# Altium schematic sheet MZ.SchDoc
size A
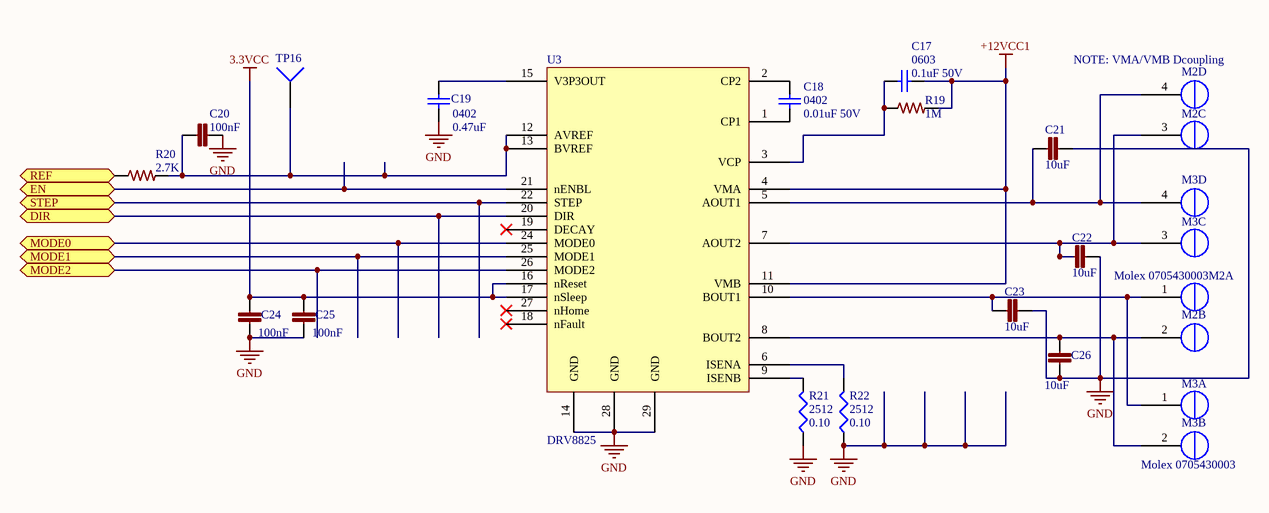
[diagram p0: MZ.SchDoc]

## Parts
C17  0603  value 0.1uF 50V  [1608[0603]]
C18  value 0.01uF 50V  [C0402]  (hidden comment: 0402)
C19  value 0.47uF  [C0402]  (hidden comment: 0402)
C20  100nF  [C0402]
C21  10uF  [C0603]
C22  10uF  [C0603]
C23  10uF  [C0603]
C24  100nF  [C0402]
C25  100nF  [C0402]
C26  10uF  [C0603]
M2  Molex 0705430003  [4POL254]  (parts A,B,C,D of 4)
M3  Molex 0705430003  [4POL254]  (parts A,B,C,D of 4)
R19  1M  [R0402]
R20  2.7K  [R0402]
R21  2512  value 0.10  [2512R-0.55]
R22  2512  value 0.10  [2512R-0.55]
TP16  TP4  [TP-2]  (value not drawn)
U3  DRV8825  [DRV8825PWPR]

## Ports
DIR, EN, MODE0, MODE1, MODE2, REF, STEP

## Nets
3.3VCC: C24.1 C25.1 U3.16(nReset) U3.17(nSleep)
+12VCC1: C17.1 R19.2 U3.4(VMA) U3.11(VMB)
GND: C19.1 C20.2 C21.2 C22.2 C23.2 C24.2 C25.2 C26.2 R21.1 R22.1 U3.14(GND) U3.28(GND) U3.29(GND)
DIR: U3.20(DIR) ; port DIR
EN: U3.21(nENBL) ; port EN
MODE0: U3.24(MODE0) ; port MODE0
MODE1: U3.25(MODE1) ; port MODE1
MODE2: U3.26(MODE2) ; port MODE2
REF: R20.1 ; port REF
STEP: U3.22(STEP) ; port STEP
NetC17_2: C17.2 R19.1 U3.3(VCP)
NetC18_1: C18.1 U3.1(CP1)
NetC18_2: C18.2 U3.2(CP2)
NetC19_2: C19.2 U3.15(V3P3OUT)
NetC20_1: C20.1 R20.2 TP16.1 U3.12(AVREF) U3.13(BVREF)
NetC21_1: C21.1 M2.4(OUT1B) M3.4(OUT1B) U3.5(AOUT1)
NetC22_1: C22.1 M2.3(OUT1A) M3.3(OUT1A) U3.7(AOUT2)
NetC23_1: C23.1 M2.1(OUT2B) M3.1(OUT2B) U3.10(BOUT1)
NetC26_1: C26.1 M2.2(OUT2A) M3.2(OUT2A) U3.8(BOUT2)
NetR21_2: R21.2 U3.9(ISENB)
NetR22_2: R22.2 U3.6(ISENA)

Not connected (* = marked no-connect by the designer): U3 18(nFault)* 19(DECAY)* 23(NC) 27(nHome)*

## Notes on the sheet
- (near M2) NOTE: VMA/VMB Dcoupling

## Library data of the parts
C17 = Cap Semi: Capacitor (Semiconductor SIM Model); Published: 8-Jun-2000; LatestRevisionDate: 29-May-2009; LatestRevisionNote: IPC-7351 Footprint Added.; PackageReference: C1206; Publisher: Altium Limited; PackageDescription: Chip Capacitor
C18 = GRM155R71H103JA88D: CAP CER 10000PF 50V X7R 0402; MFR: Murata; Tolerance: 10%; Voltage: 6.3VDC; Published: 10 - Dec - 2014; LatestRevisionDate: 10 - Dec - 2014; LatestRevisionNote: Ultimachine Footprint Added; Publisher: Ultimachine; Component Type: Chip Capacitor; MFR Part #: GRM155R71H103JA88D; Part Description: CAP CER 10000PF 50V X7R 0402; Mounting Type: SMT 0402; Datasheet: http://search.murata.co.jp/Ceramy/image/img/A01X/G101/ENG/GRM155R71H103JA88-01.pdf; Height: 0.5 ±0.05mm; Digikey #: 490-7763-1-ND; PackageReference: 0402
C19 = GRM155R60J474KE19D: 0.47uF 6.3v C0402 - GRM155R60J474KE19D; MFR: Murata; Part Description: CAP CER 0.47UF 6.3V 10% X5R 0402; Tolerance: 10%; Voltage: 6.3VDC; Published: 10 - Dec - 2014; LatestRevisionDate: 10 - Dec - 2014; LatestRevisionNote: Ultimachine Footprint Added; Publisher: Ultimachine; Component Type: Chip Capacitor; MFR Part #: GRM155R60J474KE19D; Mounting Type: SMT 0402; Datasheet: http://search.murata.co.jp/Ceramy/image/img/A01X/G101/ENG/GRM155R60J474KE19-01.pdf; Height: 0.5 ±0.05mm; PackageReference: 0402
C20 C24 C25 = GRM155R71C104KA88D: CAP CER 0402 100nF 16V 10% X7R; LastRevisionNote: ImportComponents; Published: 23-Apr-2014; Publisher: UltiMachine; LastRevisionDate: 23-Apr-2014; ManufacturerPartNumber: GRM155R71C104KA88D; VALUE: 100nF
C21-C23 C26 = CC0603ZRY5V6BB105: CAP CER 0603 1uF 10V Y5V; LastRevisionNote: ImportComponents; Published: 23-Apr-2014; Publisher: UltiMachine; LastRevisionDate: 23-Apr-2014; ManufacturerPartNumber: CC0603ZRY5V6BB105; VALUE: 10uF
M2 M3 = Molex 0705430003 Alt: Molex 4 Pin Clip Connector
R19 = ERJ2GEJ105X: RES 0402 1M 100mW 5%; LastRevisionNote: ImportComponents; Published: 23-Apr-2014; Publisher: UltiMachine; LastRevisionDate: 23-Apr-2014; ManufacturerPartNumber: ERJ2GEJ105X; VALUE: 1M
R20 = ERJ-2RKF2701X: RES SMD 2.7K OHM 1% 1/10W 0402; Manufacturer: Panasonic; ManufacturerPartNumber: ERJ2GEJ105X; LastRevisionNote: ImportComponents; Published: 23-Apr-2014; Publisher: Adam; LastRevisionDate: 23-Apr-2014; VALUE: 2.7K
R21 R22 = CSRN2512FTR100: RES SMD 0.1 OHM 1% 2W 2512; MFR: Stackpole ELectronics Inc; PackageReference: 2512; MFR #: CSRN2512FTR100; Digikey #: CSRN2512FTR100TR-ND; PDF: http://www.seielect.com/catalog/SEI-CSR_CSRN.pdf
TP16 = Socket: LatestRevisionDate: 17-Jul-2002; LatestRevisionNote: Re-released for DXP Platform.; Publisher: Altium Limited
U3 = DRV8825: DRV8825 Ti Stepper Driver; Manufacture: Texas Instruments; Mountining Type: SMD - Ti PowerPAD Package; Voltage: 8.2-45VDC; Cost (1000 qty): 2.25; Part Number: DRV8825PWPR; Status: In-Production; Pins: 28 Pins and one Exposed Pad; Datasheet: http://www.ti.com/lit/gpn/drv8825; Height: 1.2mm; Tolerance: N/A; Type: Stepper Driver - Integrated Circuit; Lead Free: YES